# EAGLE design BOOSTXL-BATPAKMKII (EAGLE 7.2.0)
COMPANY: Texas Instruments; PART#: BOOSTXL-BATPAKMKII; REV: 1.0
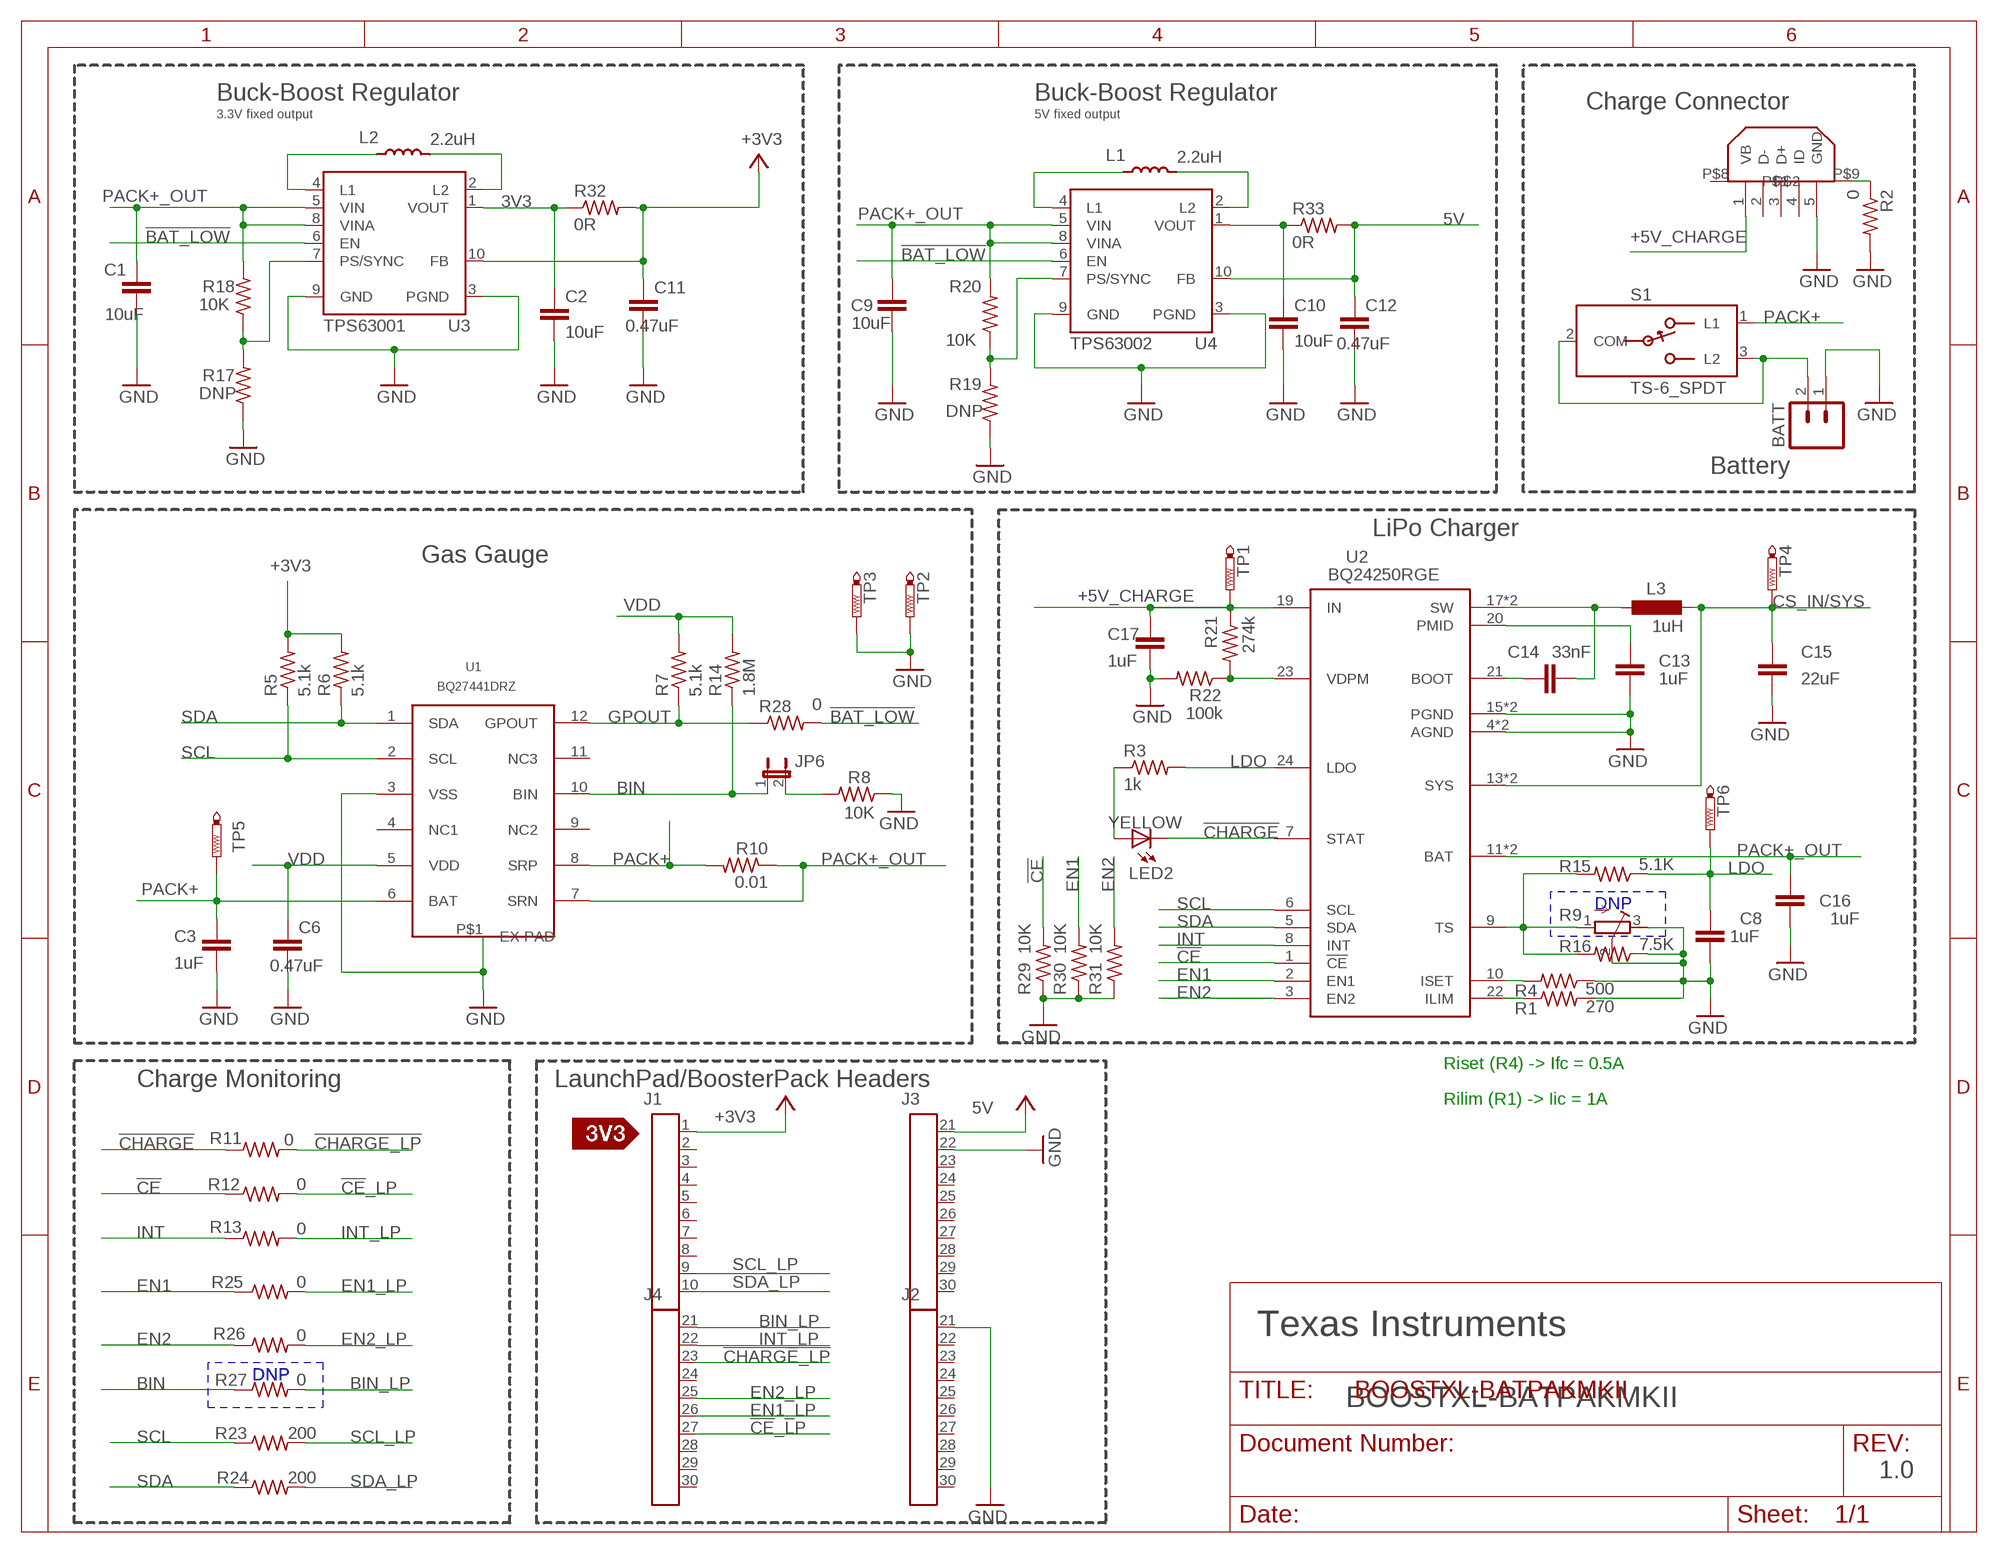
[diagram p0: schematic, sheet 1]

## Parts
BATT  M02-JST-2MM-SMT  [JST-2-SMD]
C1  10uF  C-EUC0603  [C0603]
C2  10uF  C-EUC0603  [C0603]
C3  1uF  C-EUC0603  [C0603]
C6  0.47uF  C-EUC0603  [C0603]
C8  1uF  C-EUC0603  [C0603]
C9  10uF  C-EUC0603  [C0603]
C10  10uF  C-EUC0603  [C0603]
C11  0.47uF  C-EUC0603  [C0603]
C12  0.47uF  C-EUC0603  [C0603]
C13  1uF  C-EUC0603  [C0603]
C14  33nF  C-EUC0603  [C0603]
C15  22uF  C-EUC0603  [C0603]
C16  1uF  C-EUC0603  [C0603]
C17  1uF  C-EUC0603  [C0603]
J1  HEADER1X10  [1X10]
J2  HEADER1X10-J3  [1X10-J3]
J3  HEADER1X10-J3  [1X10-J3]
J4  HEADER1X10-J3  [1X10-J3]
JP6  JP1E  [JP1]
L1  2.2uH  VLF4012A  [VLF4102A]
L2  2.2uH  VLF4012A  [VLF4102A]
L3  1uH  L-EUL3216C  [L3216C]
LED2  YELLOW  LED_1208  [RIGHTANGLE_1208]
R1  270  R-US_R0603  [R0603]
R2  0  R-US_R0603  [R0603]
R3  1k  R-US_R0603  [R0603]
R4  500  R-US_R0603  [R0603]
R5  5.1k  R-US_R0603  [R0603]
R6  5.1k  R-US_R0603  [R0603]
R7  5.1k  R-US_R0603  [R0603]
R8  10K  R-US_R0603  [R0603]
R9  R-TRIMM3296W  [RTRIM3296W]
R10  0.01  R-US_R1206  [R1206]
R11  0  R-US_R0603  [R0603]
R12  0  R-US_R0603  [R0603]
R13  0  R-US_R0603  [R0603]
R14  1.8M  R-US_R0603  [R0603]
R15  5.1K  R-US_R0603  [R0603]
R16  7.5K  R-US_R0603  [R0603]
R17  DNP  R-US_R0603  [R0603]
R18  10K  R-US_R0603  [R0603]
R19  DNP  R-US_R0603  [R0603]
R20  10K  R-US_R0603  [R0603]
R21  274k  R-US_R0603  [R0603]
R22  100k  R-US_R0603  [R0603]
R23  200  R-US_R0603  [R0603]
R24  200  R-US_R0603  [R0603]
R25  0  R-US_R0603  [R0603]
R26  0  R-US_R0603  [R0603]
R27  0  R-US_R0603  [R0603]
R28  0  R-US_R0603  [R0603]
R29  10K  R-US_R0603  [R0603]
R30  10K  R-US_R0603  [R0603]
R31  10K  R-US_R0603  [R0603]
R32  0R  R-US_R0805  [R0805]
R33  0R  R-US_R0805  [R0805]
S1  TS-6_SPDT  [TS-6_SPDT]
TP1  PTR1PAD1-13  [P1-13]
TP2  PTR1PAD1-13  [P1-13]
TP3  PTR1PAD1-13  [P1-13]
TP4  PTR1PAD1-13  [P1-13]
TP5  PTR1PAD1-13  [P1-13]
TP6  PTR1PAD1-13  [P1-13]
U1  BQ27441DRZ  [DRZ12]
U2  BQ24250RGE  [TI_RGE24]
U3  TPS63001  TPS6300  [DRC-S-PVSON-N10]
U4  TPS63002  TPS6300  [DRC-S-PVSON-N10]
U$1  SILK_3V3_TAG  [SILK_3V3_TAG]
U$2  MS_(TM)  [MS_(TM)]
USB  CONN_USB_MICRO_B  [USB_MICRO_B_SMT]

## Nets
3V3: C2.1 R32.1 U3.1(VOUT)
5V: C12.1 J3.21 R33.2 U4.10(FB)
!BAT_LOW: R28.2 U3.6(EN) U4.6(EN)
!CE: R12.1 R29.2 U2.1(!CE)
!CE!_LP: J4.27 R12.2
!CHARGE: LED2.CATHODE(C) R11.1 U2.7(STAT)
!CHARGE_LP: J4.23 R11.2
+3V3: C11.1 J1.1 R5.2 R6.2 R32.2 U3.10(FB) ; supply symbol labelled 3.3V
+5V_CHARGE: C17.1 R21.1 TP1.TP U2.19(IN) USB.1(VB)
BIN: JP6.1 R14.1 R27.1 U1.10(BIN)
BIN_LP: J4.21 R27.2
CS_IN/SYS: C15.1 L3.2 TP4.TP U2.13(SYS) U2.14(SYS)
EN1: R25.1 R30.2 U2.2(EN1)
EN1_LP: J4.26 R25.2
EN2: R26.1 R31.2 U2.3(EN2)
EN2_LP: J4.25 R26.2
GND: BATT.1 C1.2 C2.2 C3.2 C6.2 C8.2 C9.2 C10.2 C11.2 C12.2 C13.2 C15.2 C16.2 C17.2 J2.21 J3.22 R1.2 R2.2 R4.1 R8.1 R9.2(S) R9.3(A) R16.1 R17.1 R19.1 R22.2 R29.1 R30.1 R31.1 TP2.TP TP3.TP U1.3(VSS) U1.P$1(EX-PAD) U2.4(AGND) U2.15(PGND) U2.16(PGND) U2.P$1(AGND) U3.3(PGND) U3.9(GND) U4.3(PGND) U4.9(GND) USB.5(GND)
GPOUT: R7.1 R28.1 U1.12(GPOUT)
INT: R13.1 U2.8(INT)
INT_LP: J4.22 R13.2
LDO: C8.1 R3.2 R15.1 TP6.TP U2.24(LDO)
N$1: L2.P$3 U3.4(L1)
N$2: L2.P$1 U3.2(L2)
N$3: L1.P$3 U4.4(L1)
N$4: JP6.2 R8.2
N$5: LED2.ANODE(A) R3.1
N$6: L1.P$1 U4.2(L2)
N$7: R9.1(E) R15.2 R16.2 U2.9(TS)
N$8: R21.2 R22.1 U2.23(VDPM)
N$9: C13.1 U2.20(PMID)
N$10: C14.1 U2.21(BOOT)
N$11: C14.2 L3.1 U2.17(SW) U2.18(SW)
N$12: BATT.2 S1.2(COM) S1.3(L2)
N$16: R4.2 U2.10(ISET)
N$17: R2.1 USB.P$9
N$18: R17.2 R18.1 U3.7(PS/SYNC)
N$19: R19.2 R20.1 U4.7(PS/SYNC)
N$21: R1.1 U2.22(ILIM)
N$44: C10.1 R33.1 U4.1(VOUT)
PACK+: C3.1 R10.2 S1.1(L1) TP5.TP U1.6(BAT) U1.8(SRP)
PACK+_OUT: C1.1 C9.1 C16.1 R10.1 R18.2 R20.2 U1.7(SRN) U2.11(BAT) U2.12(BAT) U3.5(VIN) U3.8(VINA) U4.5(VIN) U4.8(VINA)
SCL: R5.1 R23.1 U1.2(SCL) U2.6(SCL)
SCL_LP: J1.9 R23.2
SDA: R6.1 R24.1 U1.1(SDA) U2.5(SDA)
SDA_LP: J1.10 R24.2
VDD: C6.1 R7.2 R14.2 U1.5(VDD)
Unconnected: J1.2 J1.3 J1.4 J1.5 J1.6 J1.7 J1.8 J2.22 J2.23 J2.24 J2.25 J2.26 J2.27 J2.28 J2.29 J2.30 J3.23 J3.24 J3.25 J3.26 J3.27 J3.28 J3.29 J3.30 J4.24 J4.28 J4.29 J4.30 U1.4(NC1) U1.9(NC2) U1.11(NC3) U3.TH U4.TH USB.2(D-) USB.3(D+) USB.4(ID) USB.P$8

## Notes on the sheet
- Buck-Boost Regulator | Buck-Boost Regulator
- Charge Connector
- 3.3V fixed output | 5V fixed output
- Battery
- LiPo Charger
- Gas Gauge
- DNP
- Riset (R4) -> Ifc = 0.5A
- Charge Monitoring | LaunchPad/BoosterPack Headers
- Rilim (R1) -> Iic = 1A
- DNP | DNP
- 1.0

## Library data of the parts
BATT = SparkFun:M02: Header 2 Standard 2-pin 0.1" header. Use with straight break away headers (SKU : PRT-00116), right angle break away headers (PRT-00553), swiss pins (PRT-00743), machine pins (PRT-00117), and female headers (PRT-00115). Molex polarized connector foot print use with SKU : PRT-08233 with associated crimp pins and housings.
C1-C3 C6 C8-C17 = rcl:C-EU: CAPACITOR, European symbol
J1 = circuitco-eagle:HEADER1X10
J2-J4 = circuitco-eagle:HEADER1X10-J3
JP6 = jumper:JP1E: JUMPER
L1 L2 = FuelTankV2:VLF4012A
L3 = rcl:L-EU: INDUCTOR, European symbol
LED2 = custom:LED_1208
R1-R8 R10-R33 = rcl:R-US_: RESISTOR, American symbol
R9 = resistor:R-TRIMM: Trimm resistor
S1 = MSP430_SwitchesTestpointsJumpers:TS-6_SPDT
TP1-TP6 = testpad:PTR1: TEST PIN
U1 = roy:BQ27441DRZ
U2 = roy:BQ24250RGE
U3 U4 = texas:TPS6300*: HIGH EFFICIENT SINGLE INDUCTOR BUCK-BOOST CONVERTER WITH 1.8-A SWITCHES Source: http://focus.ti.com/lit/ds/symlink/tps63001.pdf; MPN: TPS63000DRCTG4; OC_FARNELL: 1511852; OC_NEWARK: 59M7217
U$1 = MSP-EXP432:SILK_3V3_TAG
U$2 = LP_Silkscreen:MS_(TM)
USB = scarab:CONN_USB_MICRO_B

## Net classes
0 default: width 0.152 mm, drill 0.305 mm, clearance 0.152 mm

## Board
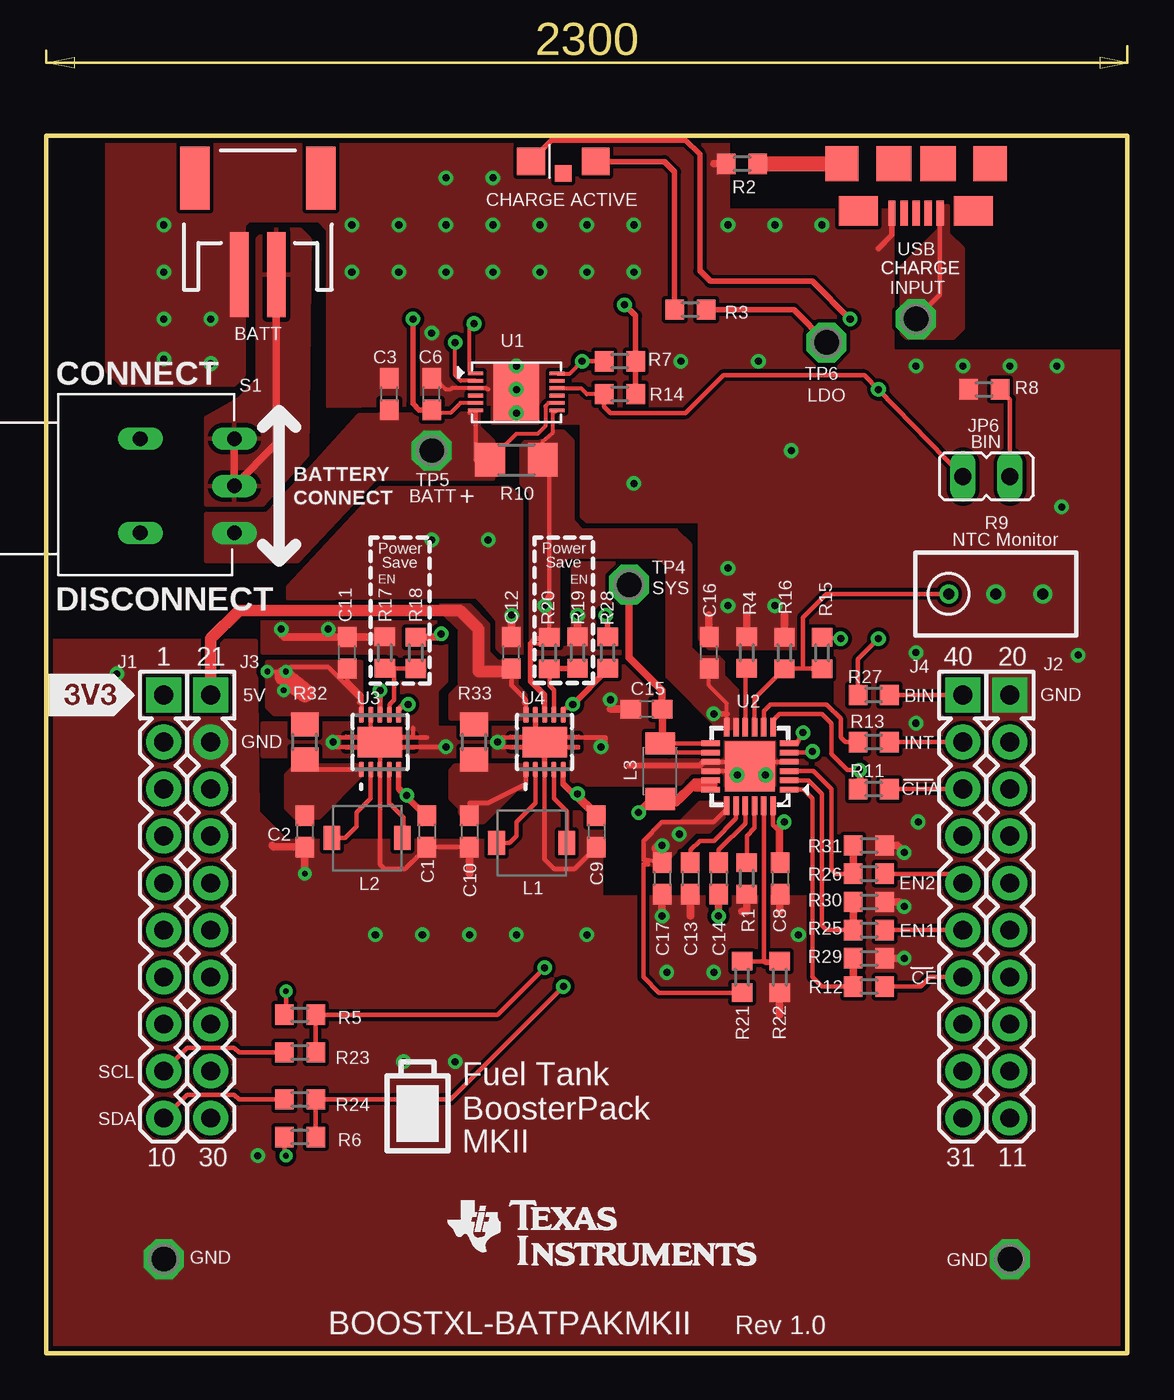
[diagram p1: board, top side]
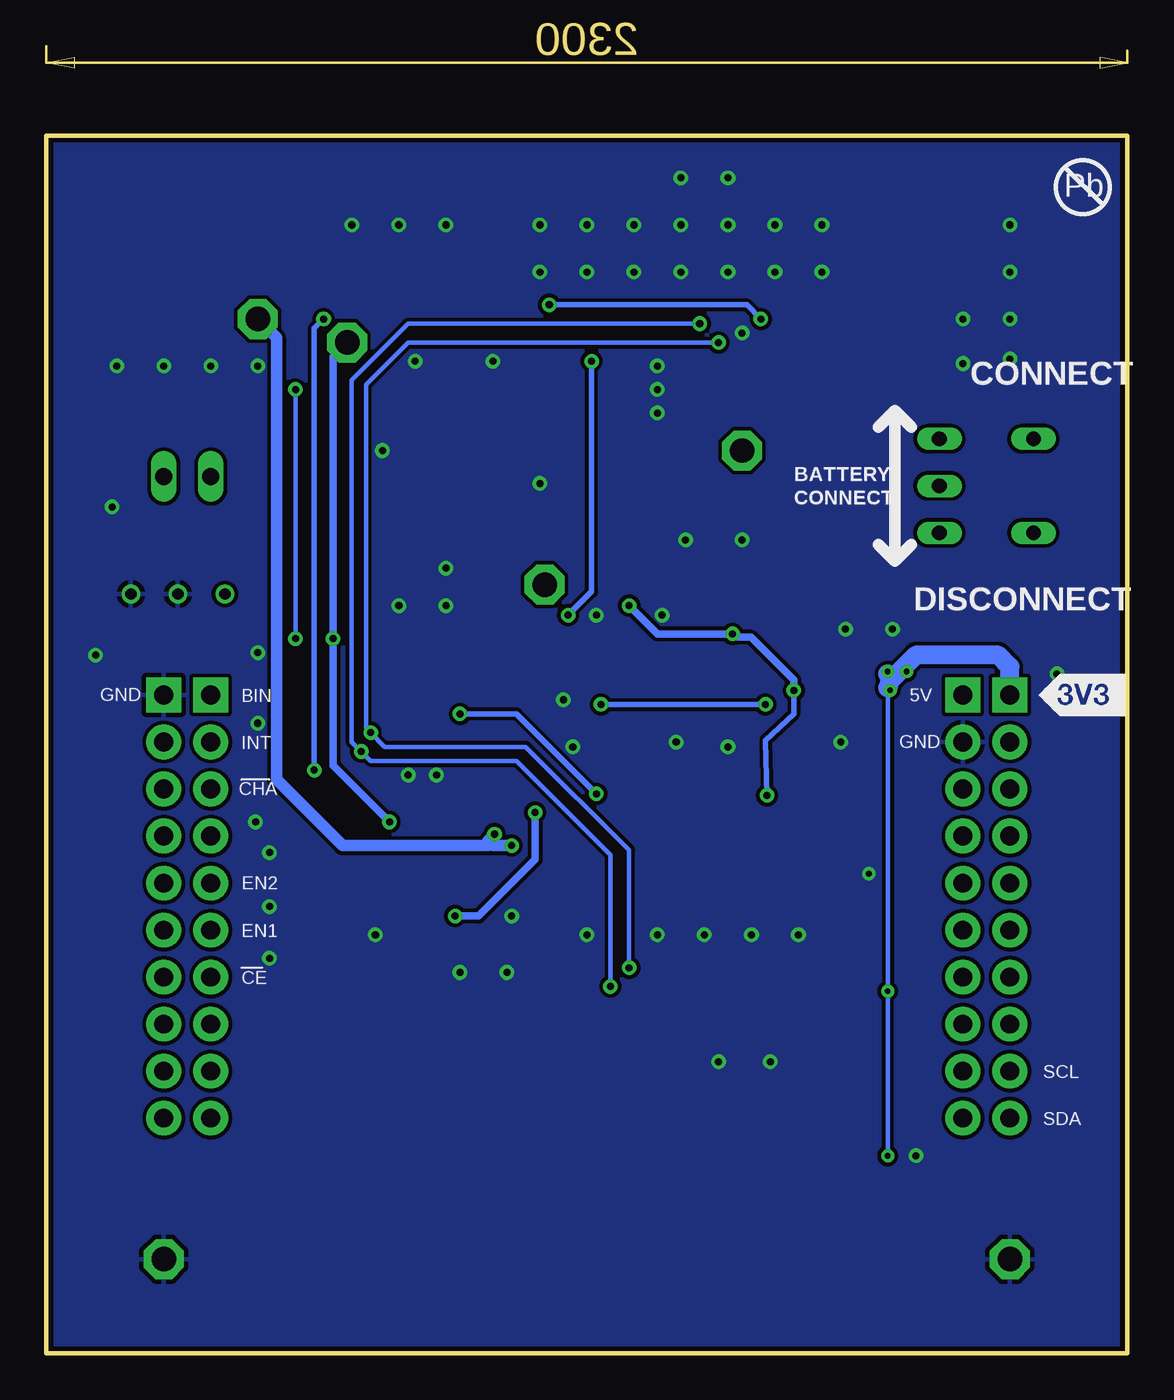
[diagram p2: board, bottom side, seen from below]

Size 58.42 x 65.79 mm. Coordinates in mm from the lower left corner, seen from the top.
Outline: 0,0 55.37,0
Outline: 0,0 58.42,0 58.42,65.79 0,65.79 0,0
Copper layers (1*16): Top 0.035mm / dielectric 1.5mm / Bottom 0.035mm
Design rules "default": minimum track width 6mil, minimum drill 10mil, track to track 8mil, track to pad 8mil, pad to pad 8mil, via to via 8mil, smd to smd 0mil, copper to edge 10mil, drill to drill 6mil, minimum pad ring 8mil, minimum via ring 8mil, stop-mask expansion 4mil, vias tented up to drill 0mil, thermal gap 10mil

### Footprints (pad centres in the part's own frame; a part is rotated, then mirrored left to right if it is on the bottom)
JST-2-SMD = smd 1 x 4.6: 1 -1,-3.7; 2 1,-3.7 | smd 1.6 x 3.4: NC1 -3.4,1.5; NC2 3.4,1.5
C0603 = smd 1.1 x 1: 1 -0.85,0; 2 0.85,0
1X10 = drill 1.016 pad 1.88 square: 1 0,10.16 | drill 1.016 pad 1.88: 2 0,7.62; 3 0,5.08; 4 0,2.54; 5 0,0; 6 0,-2.54; 7 0,-5.08; 8 0,-7.62; 9 0,-10.16; 10 0,-12.7
1X10-J3 = drill 1.016 pad 1.88 square: 21 0,10.16 | drill 1.016 pad 1.88: 22 0,7.62; 23 0,5.08; 24 0,2.54; 25 0,0; 26 0,-2.54; 27 0,-5.08; 28 0,-7.62; 29 0,-10.16; 30 0,-12.7
JP1 = drill 0.914 long: 1 0,-1.27; 2 0,1.27
VLF4102A = smd 0.9 x 1.3: P$1 0.45,0.65; P$3 4.25,0.65
L3216C = smd 1.2 x 1.6: 1 -1.5,0; 2 1.5,0
RIGHTANGLE_1208 = smd 1.5 x 1.5: ANODE 1.753,0; CATHODE -1.747,0 | smd 0.9 x 0.9: P$3 0.003,-0.65
R0603 = smd 1 x 1.1: 1 -0.85,0; 2 0.85,0
RTRIM3296W = drill 0.61: 1 0,-2.54; 2 0,0; 3 0,2.54
R1206 = smd 1.6 x 1.803: 1 -1.422,0; 2 1.422,0
R0805 = smd 1.3 x 1.5: 1 -0.95,0; 2 0.95,0
TS-6_SPDT = drill 0.8 long: 1 2.54,3.81; 2 0,3.81; 3 -2.54,3.81; 4 2.54,-1.27; 5 -2.54,-1.27
P1-13 = drill 1.321 pad 2.159 octagon: TP 0,0
DRZ12 = smd 0.2 x 0.8: 1 -1.021,-2.204; 2 -0.621,-2.204; 3 -0.221,-2.204; 4 0.179,-2.204; 5 0.579,-2.204; 6 0.979,-2.204; 7 0.979,2.196; 8 0.579,2.196; 9 0.179,2.196; 10 -0.221,2.196; 11 -0.621,2.196; 12 -1.021,2.196 | smd 3.2 x 2.45: P$1 0,0
TI_RGE24 = smd 0.3 x 1: 1 -1.25,-2.125; 2 -0.75,-2.125; 3 -0.25,-2.125; 4 0.25,-2.125; 5 0.75,-2.125; 6 1.25,-2.125; 13 1.25,2.125; 14 0.75,2.125; 15 0.25,2.125; 16 -0.25,2.125; 17 -0.75,2.125; 18 -1.25,2.125 | smd 1 x 0.3: 7 2.125,-1.25; 8 2.125,-0.75; 9 2.125,-0.25; 10 2.125,0.25; 11 2.125,0.75; 12 2.125,1.25; 19 -2.125,1.25; 20 -2.125,0.75; 21 -2.125,0.25; 22 -2.125,-0.25; 23 -2.125,-0.75; 24 -2.125,-1.25 | smd 2.7 x 2.7: P$1 0,0
DRC-S-PVSON-N10 = smd 0.28 x 0.85: 1 -1,-1.475; 2 -0.5,-1.475; 3 0,-1.475; 4 0.5,-1.475; 5 1,-1.475; 6 1,1.475; 7 0.5,1.475; 8 0,1.475; 9 -0.5,1.475; 10 -1,1.475 | smd 2.4 x 1.65: TH 0,0
USB_MICRO_B_SMT = smd 0.4 x 1.35: 1 -1.3,2.675; 2 -0.65,2.675; 3 0,2.675; 4 0.65,2.675; 5 1.3,2.675 | smd 2.1 x 1.6: P$1 -3.1,2.55; P$2 3.1,2.55 | smd 1.8 x 1.9: P$8 -4,0; P$9 4,0 | smd 1.9 x 1.9: P$10 -1.2,0; P$11 1.2,0

### Placement (x,y rotation side)
BATT  11.43,61.98 0 top
C1  20.57,28.19 270 top
C2  13.97,28.19 270 top
C3  18.54,51.82 90 top
C6  20.83,51.82 90 top
C8  39.65,25.65 270 top
C9  29.72,28.19 270 top
C10  22.86,28.19 270 top
C11  16.26,37.85 90 top
C12  25.13,37.85 90 top
C13  34.8,25.65 270 top
C14  36.32,25.65 270 top
C15  32.44,34.8 180 top
C16  35.81,37.85 90 top
C17  33.27,25.65 270 top
DRAW3  [LOGO-ROCKET-10X7MM-BRD]  35.78,9.6 7 top
J1  6.35,25.4 0 top
J2  52.07,25.4 0 top
J3  8.89,25.4 0 top
J4  49.53,25.4 0 top
JP6  50.8,47.37 270 top
L1  23.88,26.92 0 top
L2  14.99,27.18 0 top
L3  33.17,31.45 90 top
LED2  27.94,64.39 0 top
R1  37.84,25.66 270 top
R2  37.59,64.26 180 top
R3  34.8,56.39 0 top
R4  37.85,37.85 270 top
R5  13.72,18.29 180 top
R6  13.72,11.68 180 top
R7  30.99,53.59 0 top
R8  50.67,52.07 0 top
R9  51.31,41.02 270 top
R10  25.4,48.26 180 top
R11  44.7,30.48 0 top
R12  44.45,19.81 0 top
R13  44.7,33.02 0 top
R14  30.99,51.82 0 top
R15  41.92,37.84 270 top
R16  39.88,37.84 270 top
R17  18.29,37.85 270 top
R18  19.97,37.84 90 top
R19  28.7,37.85 270 top
R20  27.18,37.84 90 top
R21  37.59,20.32 90 top
R22  39.62,20.32 270 top
R23  13.72,16.26 180 top
R24  13.72,13.72 180 top
R25  44.45,22.86 0 top
R26  44.45,25.91 0 top
R27  44.7,35.56 0 top
R28  30.33,37.85 270 top
R29  44.45,21.34 180 top
R30  44.45,24.38 180 top
R31  44.45,27.43 180 top
R32  13.97,33.02 90 top
R33  23.11,33.02 90 top
S1  6.35,46.86 270 top
TP1  46.99,55.88 0 top
TP2  6.35,5.08 0 top
TP3  52.07,5.08 0 top
TP4  31.5,41.53 0 top
TP5  20.83,48.77 0 top
TP6  42.16,54.61 0 top
U1  25.4,51.92 270 top
U2  38.02,31.7 90 top
U3  18.03,33.02 0 top
U4  26.92,33.02 0 top
U$1  0,34.42 0 top
U$2  4.06,45.85 0 top
U$4  [LOGO16_TPLACE]  21.59,4.57 0 top
USB  46.99,64.26 180 top

### Tracks (layer width: path | path; a pad name or v marks a point on that pad's centre or on a via)
3V3
  Top 0.254: U3.1 14.65,31.55
  pour Top (no thermals): 17.02,31.75 13.46,31.75 12.95,31.24 12.95,29.46 13.46,28.96 14.73,28.96 17.02,31.24
5V
  Top 0.254: U4.10 25.92,35.05 | 25.92,35.05 25.92,35.29 25.15,36.07 25.15,37.08 25.13,37.07 C12.1 | 25.81,35.17 25.92,35.05
  Top 0.61: J3.21 8.89,38.61 10.41,40.13 22.35,40.13 23.37,39.12 23.37,36.83 24.79,36.83 C12.1
  pour Top (no thermals): 21.34,40.39 22.86,40.39 23.88,39.37 23.88,37.85 24.38,37.34 24.89,37.34 25.4,36.83 25.4,36.07 25.91,35.56 25.91,34.29 21.84,34.29 21.84,35.56 22.35,36.07 22.35,39.12 21.34,40.13
!BAT_LOW  (via drill 0.38)
  Top 0.305: U3.6 19.03,34.78 19.3,35.05 v19.56,35.05 | U4.6 27.92,34.78 v28.45,35.05 30.33,36.93 R28.2
  Bottom 0.305: v28.45,35.05 v19.56,35.05
!CE
  Top 0.254: U2.1 40.93,30.45 41.4,29.97 41.4,20.32 41.91,19.81 R12.1
  Top 0.406: R29.2 R12.1
!CE!_LP
  Top 0.254: R12.2 47.24,19.81 47.75,20.32 J4.27
!CHARGE  (via drill 0.38)
  Top 0.254: U2.7 39.27,34.19 39.62,34.54 41.91,34.54 42.42,34.04 42.42,32.38 43.29,31.51 v43.94,31.51 44.2,30.23 | R11.1 44.11,30.31 44.07,30.35
  Top 0.305: LED2.CATHODE 26.16,64.39 27.3,65.53 34.54,65.53 35.31,64.77 35.31,58.48 35.88,57.91 41.4,57.91 v43.43,55.88 | v43.94,31.51 43.94,30.48 44.07,30.35 44.2,30.23
  Bottom 0.305: v43.43,55.88 43.94,55.37 v43.94,31.51
!CHARGE_LP
  Top 0.254: R11.2 J4.23
+3V3  (via drill 0.3)
  Top 0.203: 16.92,35.17 17.03,35.29 | v11.94,36.83 v12.95,36.83
  Top 0.254: U3.10 17.03,35.05 | 17.03,35.05 17.03,35.29 | 17.03,35.29 17.03,35.54 16.26,36.32 C11.1 | 16.92,35.17 17.03,35.05 | 17.03,35.29 15.24,37.08 13.21,37.08 v12.95,36.83 | v12.95,19.56 12.95,18.38 R5.2 | R6.2 12.87,10.76 v12.95,10.67
  Top 0.406: 12.83,36.58 12.95,36.58 v12.95,36.83
  Top 1.016: 13.97,35.69 12.83,36.58
  Bottom 0.254: v12.95,36.83 12.95,35.94 v12.95,19.56 v12.95,10.67
  Bottom 0.406: v12.83,35.81 12.83,35.94 12.95,35.94
  Bottom 1.016: 12.83,36.32 11.43,37.72 6.98,37.72 6.35,37.08 J1.1 | 12.83,36.32 12.95,35.94 | 12.83,36.32 12.83,36.58 12.95,36.7
  pour Top (no thermals): 17.02,37.34 11.94,37.34 11.94,34.92 12.32,34.54 17.02,34.54
+5V_CHARGE  (via drill 0.38)
  Top 0.254: U2.19 36.77,29.41 36.07,28.7 33.27,28.7 32.26,27.69 32.26,26.67 | 32.26,26.67 C17.1 | R21.1 33.11,19.47 32.26,20.32 32.26,26.42 32.51,26.42 32.26,26.67 | USB.1 48.29,57.18 TP1.TP
  Top 0.61: v33.27,27.43 33.02,27.27 C17.1
  Bottom 0.61: TP1.TP 45.97,54.86 45.97,30.99 42.42,27.43 34.54,27.43 34.54,27.7 v34.2,28.04 34.29,27.95 34.29,27.43 v33.27,27.43
  pour Top (no thermals): 36.58,29.72 36.58,28.96 35.81,28.19 35.05,28.19 33.27,26.42 32.26,26.42 32.26,27.69 33.27,28.7 34.29,28.7 35.31,29.72
  pour Top (no thermals): 48.26,61.98 48.26,60.71 46.23,58.67 46.23,55.12 46.48,54.86 49.02,54.86 49.53,55.37 49.53,59.69 48.7,60.45 48.7,61.98
BIN  (via drill 0.38)
  Top 0.203: 30.16,51.82 R14.1 29.21,51.82 28.89,52.14 U1.10
  Top 0.254: R27.1 43.85,37.5 v44.96,38.61 | R14.1 30.14,51.14 30.48,50.8 34.54,50.8 36.58,52.83 44.2,52.83 v44.96,52.07 JP6.1
  Bottom 0.254: v44.96,38.61 v44.96,52.07
BIN_LP
  Top 0.254: R27.2 J4.21
CS_IN/SYS
  Top 0.254: U2.13 L3.2 | U2.14 33.67,32.45 L3.2 | 33.29,33.06 L3.2 | 33.27,34.8 C15.1 | 33.29,33.03 33.26,33.03 L3.2
  Top 0.406: TP4.TP 31.5,37.59 33.27,35.81 33.27,34.8 | C15.1 33.29,33.03 33.27,33.02
EN1
  Top 0.254: R25.1 42.16,22.86 41.91,23.11 41.91,30.23 41.19,30.95 U2.2
  Top 0.406: R30.2 R25.1
EN1_LP
  Top 0.254: J4.26 R25.2
EN2
  Top 0.254: U2.3 41.45,31.45 42.42,30.48 42.42,26.16 42.67,25.91 R26.1
  Top 0.406: R31.2 R26.1
EN2_LP
  Top 0.254: R26.2 49.02,25.91 J4.25
GND  (via drill 0.3, 0.38)
  Top 0.203: U1.3 23.81,52.14 23.88,52.07 23.82,52.07 23.76,52.13 21.91,52.13 21.84,52.07 21.59,52.07 20.83,52.83
  Top 0.254: U2.4 38.27,31.95 U2.P$1 37.77,31.95 37.34,31.95 | U2.15 37.34,31.95 | U2.16 36.84,31.45 37.34,31.95 | U4.3 26.92,26.67 27.43,26.16 28.54,26.16 C9.2 | C10.2 C1.2 19.39,26.16 18.29,26.16 18.03,26.42 U3.3 18.03,33.27 | 18.03,33.27 17.53,33.77 U3.9 | U3.9 17.53,33.27 15.49,33.27 15.49,32.77 v21.59,32.77 | 30.23,32.77 30.23,33.27 24.38,33.27 24.38,32.77 26.92,32.77 | U3.9 17.53,34.8 | 19.81,33.27 19.81,33.78 | 18.03,33.27 19.81,33.27 | 19.81,33.27 20.57,33.27
  Top 0.305: USB.5 45.69,60.42 44.96,59.69 | U4.9 26.42,33.52 26.92,33.02 26.92,32.77 U4.3 | U2.15 35.51,31.95 35.31,31.75 31.5,31.75
  Top 0.406: R2.2 36.07,64.26 | R19.1 v28.7,39.88 | C15.2 30.48,34.8 | C12.2 25.13,39.87 v25.15,39.88 | C11.2 R17.1 12.86,38.7 12.7,38.86 | v13.97,25.91 C2.2 12.28,27.34 12.19,27.43 | C10.2 22.86,25.91 | C13.2 34.8,23.62 | C17.2 v33.27,23.62 | R1.2 37.84,23.88 37.59,23.88 | C8.2 39.65,23.9 39.62,23.88 | R22.2 39.62,18.29 | R4.1 37.85,39.88 | R16.1 39.88,39.87 39.88,39.88 | C16.2 35.81,39.88 | R31.1 45.97,27.43 v46.36,27.05 | R30.1 46.1,24.38 v46.36,24.13 | R29.1 v46.36,21.34
  other vias: 3.81,36.7 21.59,63.5 24.13,60.96 24.13,63.5 26.67,60.96 29.21,60.96 36.83,42.42 31.75,60.96 36.83,60.96 39.37,60.96 41.91,60.96 38.48,53.59 46.99,53.34 49.53,53.34 52.07,53.34 54.61,53.34 36.83,40.39 39.37,40.39 47.12,28.7 54.86,45.72 55.75,37.72 46.99,37.85 46.99,34.04 26.67,58.42 29.21,58.42 31.75,58.42 40.26,48.77 15.24,39.12 12.7,39.12 30.48,35.31 17.78,22.61 20.32,22.61 22.86,22.61 25.4,22.61 29.21,22.61 40.64,22.61 23.88,43.94 8.89,55.88 6.35,55.88 6.35,53.72 8.89,53.47 6.35,58.42 16.51,58.42 19.05,58.42 21.59,58.42 24.13,58.42 21.59,60.96 19.05,60.96 16.51,60.96 6.35,60.96 25.4,53.34 25.4,52.07 25.4,50.8 20.83,43.94 34.29,53.59 31.75,46.99 20.83,55.12 29.97,32.77 37.34,31.24 38.86,31.24 33.53,20.57 36.07,20.57 11.43,10.67 19.3,15.75 22.1,15.75 15.49,33.02 24.38,33.02
  pour Bottom: 0,65.79 0,0 58.42,0 58.42,65.79
  pour Top (no thermals): 3.3,53.09 3.3,65.79 36.83,65.79 36.83,61.73 45.72,61.73 45.72,54.1 58.42,54.1 58.42,0 0,0 0,38.48 11.3,38.48 11.3,37.85 11.43,29.21 12.95,27.69 24.89,27.69 26.16,29.21 29.97,29.21 29.97,24.64 41.4,24.64 41.91,25.15 41.91,30.23 41.4,30.73 28.45,30.73 27.94,32.26 11.68,32.26 11.68,34.04 18.54,34.04 18.54,37.85 11.68,37.85 11.68,39.62 21.08,39.62 21.59,39.12 21.59,36.32 21.08,35.81 21.08,33.78 26.67,33.78 26.67,36.83 25.4,37.85 24.64,37.85 24.38,38.1 24.38,39.62 23.62,40.51 23.24,40.89 13.08,40.77 13.08,41.4 18.03,46.74 25.02,46.74 25.65,46.1 25.65,38.35 25.91,38.1 28.19,38.1 28.45,38.35 28.45,42.42 28.7,42.67 32.51,42.67 33.02,42.16 33.02,36.07 35.81,33.27 42.67,33.27 42.67,37.85 42.42,38.1 35.81,38.1 35.31,38.61 35.31,44.96 29.21,44.96 28.96,45.21 28.96,50.29 24.13,50.29 24.13,51.31 15.24,51.18 15.24,60.71 14.73,61.21 10.92,61.21 10.67,60.96 10.67,52.83 10.16,52.32 4.06,52.32
GPOUT  (via drill 0.38)
  Top 0.203: U1.12 28.3,52.94 v28.96,53.59
  Top 0.254: v28.96,53.59 R7.1
  Top 0.305: R28.1 30.33,39.78 v30.23,39.88
  Bottom 0.305: v30.23,39.88 28.96,41.15 v28.96,53.59
INT
  Top 0.254: U2.8 38.77,34.71 39.12,35.05 42.16,35.05 42.93,34.29 42.93,33.27 43.18,33.02 R13.1
INT_LP
  Top 0.254: R13.2 J4.22
LDO  (via drill 0.38)
  Top 0.254: U2.24 39.27,28.54 39.62,28.19 39.62,26.53 C8.1 39.65,26.44 39.62,26.42 | R15.1 42.25,38.69 v42.93,38.61
  Top 0.305: TP6.TP 40.39,56.39 R3.2
  Top 0.406: v39.88,28.7 39.62,28.45 39.62,26.42
  Bottom 0.406: TP6.TP 42.93,53.85 v42.93,38.61 42.93,31.75 v39.88,28.7
N$1
  Top 0.254: U3.4 18.53,29.73 19.3,28.96 19.3,27.9 L2.P$3
N$2
  Top 0.254: L2.P$1 16.14,27.83 16.76,28.45 16.76,29.21 17.53,29.98 U3.2
N$3
  Top 0.254: L1.P$3 28.13,29.28 27.43,29.97 27.43,31.54 U4.4
N$4
  Top 0.254: JP6.2 52.07,51.52 R8.2
N$5
  Top 0.305: LED2.ANODE 33.4,64.39 33.95,63.84 R3.1
N$6
  Top 0.254: U4.2 26.42,29.73 25.4,28.7 25.4,27.94 25.03,27.57 L1.P$1
N$7
  Top 0.254: R16.2 R15.2 | U2.9 38.27,35.38 R16.2 | R16.2 40.8,36.99 40.89,37.08 40.89,39.75 42.16,41.02 R9.1
N$8
  Top 0.254: U2.23 38.77,21.17 38.86,21.08 39.54,21.08 R22.1 R21.2
N$9
  Top 0.254: C13.1 34.8,27.18 35.31,27.69 36.07,27.69 37.27,28.89 U2.20
N$10
  Top 0.254: U2.21 37.77,28.63 36.32,27.18 C14.1
N$11  (via drill 0.38)
  Top 0.254: U2.17 35.01,30.95 34.8,30.73 | U2.18 35.08,30.45 34.8,30.73 | 33.29,29.83 L3.1 34.01,29.95 34.8,30.73
  Top 0.406: 34.01,29.95 34.26,29.95 | 34.26,29.95 35.05,30.73 36.07,30.73 | 34.26,29.95 34.04,29.72 32.51,29.72 v32,29.21 | v36.32,23.62 C14.2
  Bottom 0.406: v32,29.21 32,26.67 35.05,23.62 v36.32,23.62
N$12
  Top 0.406: S1.3 S1.2 12.43,49.13 BATT.2
  pour Top: 11.43,60.2 11.43,52.58 10.41,51.56 8.64,50.55 8.64,45.85 11.68,45.85 14.1,48.51 14.22,60.2 13.72,60.71 11.94,60.71
N$16
  Top 0.254: U2.10 37.77,36.92 R4.2
N$17
  Top 0.813: R2.1 USB.P$9
N$18
  Top 0.254: U3.7 18.54,35.05 18.8,35.31 18.79,35.31 18.79,36.08 18.8,36.83 R17.2 20.35,37 R18.1
N$19
  Top 0.254: U4.7 27.42,35.82 27.18,36.07 R20.1
  Top 0.305: R20.1 R19.2
N$21
  Top 0.254: U2.22 38.27,28.37 37.85,27.94 R1.1
N$44
  Top 0.254: C10.1 22.86,29.72 23.88,29.72 25.92,30.75 U4.1
  pour Top (no thermals): 25.91,31.75 22.1,31.75 21.84,31.5 21.84,29.97 22.35,29.46 22.35,29.21 22.86,28.7 23.62,28.7 25.4,30.48 25.91,30.48
PACK+
  Top 0.203: U1.8 27.13,51.34 26.96,51.17 26.96,50.1 26.53,49.67 25.39,49.67 R10.2 | U1.6 23,50.94 22.86,50.8
  Top 0.254: R10.2 23.2,48.26 U1.6
  pour Top (no thermals): 8.64,42.8 13.59,42.8 17.78,47.24 24.13,47.24 24.13,49.28 23.37,50.04 23.37,50.8 16.89,50.67 14.35,47.88 11.94,45.34 8.64,45.34
PACK+_OUT  (via drill 0.38)
  Top 0.203: U1.7 27.37,50.83 27.37,49.73 26.82,49.25 R10.1 27.18,47.9 27.18,40.89 | 26.42,38.61 27.1,38.61 R20.2 | 26.16,38.35 26.92,38.35 27.18,38.61 27.18,40.13 v26.92,40.39 | U2.12 36.77,34.54 36.77,35.11 35.81,36.07 C16.1
  Top 0.254: U3.5 19.03,30.58 v19.47,30.14 C1.1 | U4.5 27.92,30.84 C9.1
  Top 0.305: U3.5 19.03,30.5 19.22,30.31 | 19.22,30.31 20.57,28.96 | U3.8 v18.03,35.81 | v19.47,30.14 19.22,30.31 | U4.5 27.92,30.75 29.72,28.96 | U4.8 26.92,35.56 26.16,36.32 26.16,38.35 26.42,38.61 26.92,38.61 | C9.1 29.72,29.21 v28.7,30.23 | v36.07,34.54 36.77,34.54
  Top 0.406: R18.2 21.17,38.69 v21.34,38.86 | v26.92,40.39 27.18,40.89
  Bottom 0.305: v18.03,35.81 18.03,34.54 19.56,33.11 v19.47,30.14 | v28.7,30.23 33.02,34.54 v36.07,34.54
  Bottom 0.406: v26.92,40.39 25.4,38.86 v21.34,38.86 21.17,38.69 20.35,38.69 18.03,36.38 v18.03,35.81
  pour Top (no thermals): 25.65,49.02 25.65,46.99 26.16,46.48 26.16,38.61 27.69,38.61 27.69,42.55 28.19,43.05 33.02,43.05 33.53,42.55 33.53,36.58 36.32,33.78 37.34,33.78 37.34,35.81 36.58,36.58 36.58,37.34 36.32,37.59 35.31,37.59 34.8,38.1 34.8,43.69 34.04,44.45 28.96,44.45 28.45,44.96 28.45,49.28 27.94,49.78 27.43,49.78 26.92,49.28 25.91,49.28
SCL  (via drill 0.38)
  Top 0.203: U1.2 22.39,52.54 22.1,52.83 v22.1,54.61
  Top 0.254: R23.1 R5.1 24.38,18.29 v26.92,20.83 | U2.6 40.57,32.95 v40.89,33.53
  Bottom 0.254: v26.92,20.83 26.92,27.18 32.51,32.77 40.13,32.77 v40.89,33.53 41.15,33.78 41.15,52.32 38.86,54.61 v22.1,54.61
SCL_LP
  Top 0.254: R23.2 10.41,16.26 10.16,16.51 7.62,16.51 J1.9
SDA  (via drill 0.38)
  Top 0.203: U1.1 23.01,52.94 22.86,53.09 22.86,55.37 v23.11,55.63
  Top 0.254: R6.1 R24.1 21.84,13.72 v27.94,19.81 | U2.5 41.09,32.45 v41.4,32.51
  Bottom 0.254: v27.94,19.81 27.94,26.92 33.02,32 40.89,32 v41.4,32.51 41.91,33.02 41.91,52.58 38.86,55.63 v23.11,55.63
SDA_LP
  Top 0.254: R24.2 10.41,13.72 10.16,13.97 7.62,13.97 J1.10
VDD  (via drill 0.38)
  Top 0.203: U1.5 22.38,51.34 21.84,50.8 20.99,50.8 C6.1
  Top 0.305: v31.24,56.64 31.84,56.05 R7.2 R14.2 | v19.81,55.88 19.81,51.31 20.15,50.97 C6.1
  Bottom 0.305: v31.24,56.64 20.57,56.64 v19.81,55.88

### Text on the board
tPlace: CHARGE ACTIVE | CONNECT | BIN | BATTERY | CONNECT | + | NTC Monitor | Power | Power | EN | Save | Save | EN | DISCONNECT | 1 | 21 | 40 | 20 | GND | GND | CHA | Fuel Tank | BoosterPack | MKII | 10 | 30 | 31 | 11 | BOOSTXL-BATPAKMKII | Rev 1.0
bPlace: Pb | CONNECT | BATTERY | CONNECT | DISCONNECT | GND | CHA
tNames: USB | CHARGE | CHARGE | INPUT | BATT | LDO | BATT | SYS | 5V | BIN | INT | EN2 | EN1 | CE | SCL | SDA | GND | GND
bNames: 5V | BIN | GND | INT | EN2 | EN1 | CE | SCL | SDA